# Altium project R00M20GSMD_A9_Single_Stage_LNA_JX7820.9869A2.0.PrjPcb
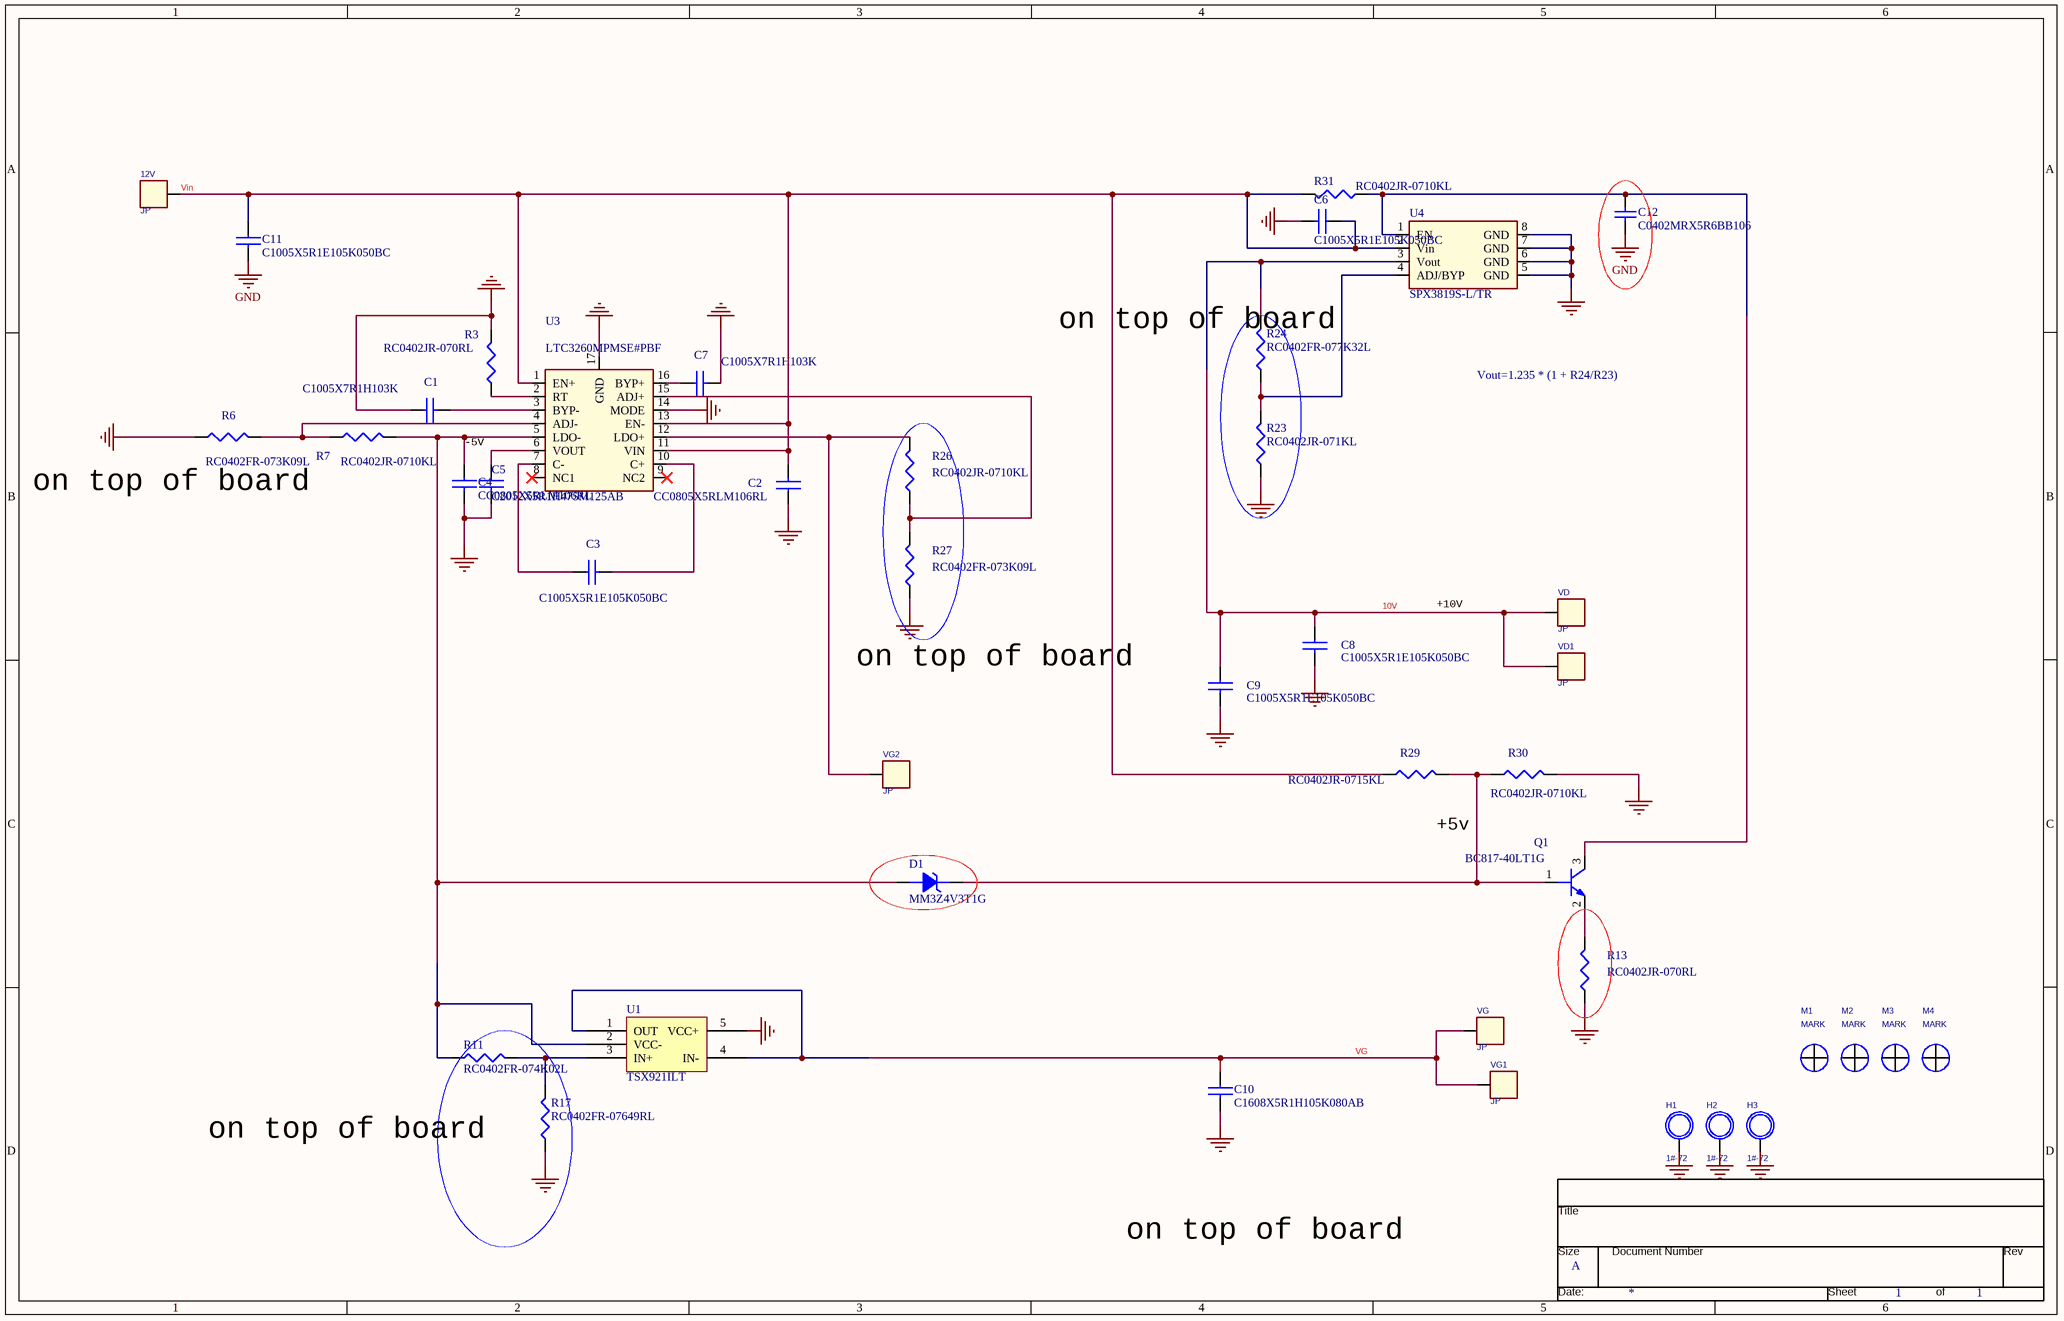
[diagram p0: 1) DC_DC.SchDoc]
1 sheet, 44 parts. Net scope: global (net labels, ports and power ports of the same name join across sheets).
Board file: Single_Stage_LNA_JX7820.9869A2.PcbDoc

## Sheet 1) DC_DC.SchDoc
size 386 x 246 mm

### Parts
12V  JP  [JP_2.5X1.8]
*  Page Count: 1  Page Size: A  (hidden comment: TitleBlock0)  (graphical)
C1  C1005X7R1H103K  [C0402]
C2  CC0805X5RLM106RL  [C0805]
C3  C1005X5R1E105K050BC  [C0402]
C4  CC0805X5RLM106RL  [C0805]
C5  C2012X5R1H475M125AB  [C0805]
C6  C1005X5R1E105K050BC  [C0402]
C7  C1005X7R1H103K  [C0402]
C8  C1005X5R1E105K050BC  [C0402]
C9  C1005X5R1E105K050BC  [C0402]
C10  C1608X5R1H105K080AB  [C0603]
C11  C1005X5R1E105K050BC  [C0402]
C12  C0402MRX5R6BB106  [C0402]
D1  MM3Z4V3T1G  [SOD-323]
H1  1#-72  [P3.2-1.8]
H2  1#-72  [P3.2-1.8]
H3  1#-72  [P3.2-1.8]
M1  MARK  [MARK]
M2  MARK  [MARK]
M3  MARK  [MARK]
M4  MARK  [MARK]
Q1  BC817-40LT1G  [SOT-23]
R3  RC0402JR-070RL  [R0402]
R6  RC0402FR-073K09L  [R0402]
R7  RC0402JR-0710KL  [R0402]
R11  RC0402FR-074K02L  [R0402]
R13  RC0402JR-070RL  [R0402]
R17  RC0402FR-07649RL  [R0402]
R23  RC0402JR-071KL  [R0402]
R24  RC0402FR-077K32L  [R0402]
R26  RC0402JR-0710KL  [R0402]
R27  RC0402FR-073K09L  [R0402]
R29  RC0402JR-0715KL  [R0402]
R30  RC0402JR-0710KL  [R0402]
R31  RC0402JR-0710KL  [R0402]
U1  TSX921ILT  [SOT-23-5]
U3  LTC3260MPMSE#PBF  [MSOP-16-EP]
U4  SPX3819S-L/TR  [SOIC-8]
VD  JP  [P3.2]
VD1  JP  [P3.2]
VG  JP  [P3.2]
VG1  JP  [P3.2]
VG2  JP  [JP_1.5X1.5]

### Nets
GND: C1.1 C2.1 C4.2 C5.2 C6.2 C7.2 C8.2 C9.2 C10.2 C11.2 C12.2 H1.1 H2.1 H3.1 R3.2 R6.1 R13.1 R17.1 R23.1 R27.1 R30.1 U1.5(VCC+) U3.14(MODE) U3.17(GND) U4.5(GND) U4.6(GND) U4.7(GND) U4.8(GND)
10V: C8.1 C9.1 R24.2 U4.3(Vout) VD.1 VD1.1
VG: C10.1 U1.1(OUT) U1.4(IN-) VG.1 VG1.1
Vin: 12V.1 C2.2 C6.1 C11.1 R29.2 R31.2 U3.1(EN+) U3.11(VIN) U3.13(EN-) U4.2(Vin)
NetC1_2: C1.2 U3.3(BYP-)
NetC3_1: C3.1 U3.7(C-)
NetC3_2: C3.2 U3.10(C+)
NetC4_1: C4.1 D1.2 R7.2 R11.1 U1.2(VCC-) U3.5(LDO-)
NetC5_1: C5.1 U3.6(VOUT)
NetC7_1: C7.1 U3.16(BYP+)
NetC12_1: C12.1 Q1.3(C) R31.1 U4.1(EN)
NetD1_1: D1.1 Q1.1(B) R29.1 R30.2
NetQ1_2: Q1.2(E) R13.2
NetR3_1: R3.1 U3.2(RT)
NetR6_2: R6.2 R7.1 U3.4(ADJ-)
NetR11_2: R11.2 R17.2 U1.3(IN+)
NetR23_2: R23.2 R24.1 U4.4(ADJ/BYP)
NetR26_1: R26.1 R27.2 U3.15(ADJ+)
NetR26_2: R26.2 U3.12(LDO+) VG2.1

Not connected (* = marked no-connect by the designer): M1 1; M2 1; M3 1; M4 1; U3 8(NC1)* 9(NC2)*

### Notes on the sheet
- (near R24) on top of board
- Vout=1.235 * (1 + R24/R23)
- -5V
- (near R6) on top of board
- on top of board
- +10V
- +5v
- (in symbol TitleBlock0) Title; Size; Document Number; Rev; Date:; Sheet; of

### Library data of the parts
C1 C7 = C1005X7R1H103K050BB: 贴片电容_X7R_50V_0.01UF_±10%; 物料名称: 通用电容; 制造商: TDK; 物料代码: 1245000201
C2 = CC0805X5RLM106RL: Ceramic_10uF_20%_X5R_35V; 物料代码: 1245000242; 制造商: TDK; 物料名称: 通用电容
C3 C6 C8 C9 C11 = C1005X5R1E105K050BC: 0402_1UF_25V_±10%; 物料名称: 通用电容; 制造商: TDK; 物料代码: 1245000247
C4 = CC0805X5RLM106RL: Ceramic_10uF_20%_X5R_35V; 物料名称: 通用电容; 制造商: TDK; 物料代码: 1245000242
C5 = C2012X5R1H475M125AB: 0805_4.7UF 50V ±20％; 物料代码: 1245000215; 制造商: TDK; 物料名称: 通用电容
C10 = C1608X5R1H105K080AB: 0603_1UF_50V; 物料名称: 通用电容; 制造商: TDK; 物料代码: 1245000255
C12 = C0402MRX5R6BB106: Ceramic_10000000pF_20%_10V_ppm/℃; PartNo: 1245000136; Manufacture/Vendor: YAGEO; Name（Chinese）: 通用电容; Name（English）: Capacitors; Package: 0402
D1 = MM3Z4V3T1G: 通用二极管_稳压二极管_4.3V_200mW; 物料名称: 通用二极管; 制造商: Onsemi; 物料代码: 1228000005
Q1 = BC817-40LT1G: 通用BJT_NPN_45V_0.5A; 物料名称: 通用BJT; 制造商: Onsemi; 物料代码: 1225000002
R3 = RC0402JR-070RL: 0402_0Ω_1/16W_±1%; 物料名称: 通用电阻; 物料代码: 1231000567; 制造商: YAGEO
R6 R27 = RC0402FR-073K09L: 0402-3.09K ±1%; 物料名称: 通用电阻; 物料代码: 1231000503; 制造商: YAGEO
R7 R26 R30 R31 = RC0402JR-0710KL: Thick Film-SMD/SMT_10kΩ_5%; 物料名称: 通用电阻; 物料代码: 1231000312; 制造商: YAGEO
R11 = RC0402FR-074K02L: 0402_4.02K_±1%; 物料名称: 通用电阻; 物料代码: 1231000444; 制造商: YAGEO
R13 = RC0402JR-070RL: General Purpose Resistors_0Ω_0±%_0.0625W; PartNo: 1231000567; Manufacture/Vendor: YAGEO; Name（Chinese）: 通用电阻; Name（English）: Resistors; Package: 0402
R17 = RC0402FR-07649RL: 0402-649Ω-±1%; 物料名称: 通用电阻; 物料代码: 1231000389; 制造商: YAGEO
R23 = RC0402JR-071KL: 贴片电阻_1KΩ_5%_100ppm_50V_1/16W; 物料名称: 通用电阻; 物料代码: 1231000314; 制造商: YAGEO
R24 = RC0402FR-077K32L: 0402_7.32K_1/16W_±1%; 物料名称: 通用电阻; 物料代码: 1231000565; 制造商: YAGEO
R29 = RC0402JR-0715KL: 0402_15K_±5%; 物料名称: 通用电阻; 物料代码: 1231000432; 制造商: YAGEO
U3 = LTC3260EMSE: 电源IC_双极性输出电荷泵_4.5～32V_100mA; 物料名称: 电源IC; 制造商: LT; 物料代码: 1218000027
U4 = SPX3819S-L/TR: IC REG LIN POS ADJ 500MA 8SOIC; 制造商: maxim
* = TitleBlock0: Page Number: 1; Page Create Date: March  8, 1995; Page Modify Date: *